# Altium schematic sheet Power_Supply_And_Regulator.SchDoc
size A4; DocumentNumber: 4; SheetNumber: 4
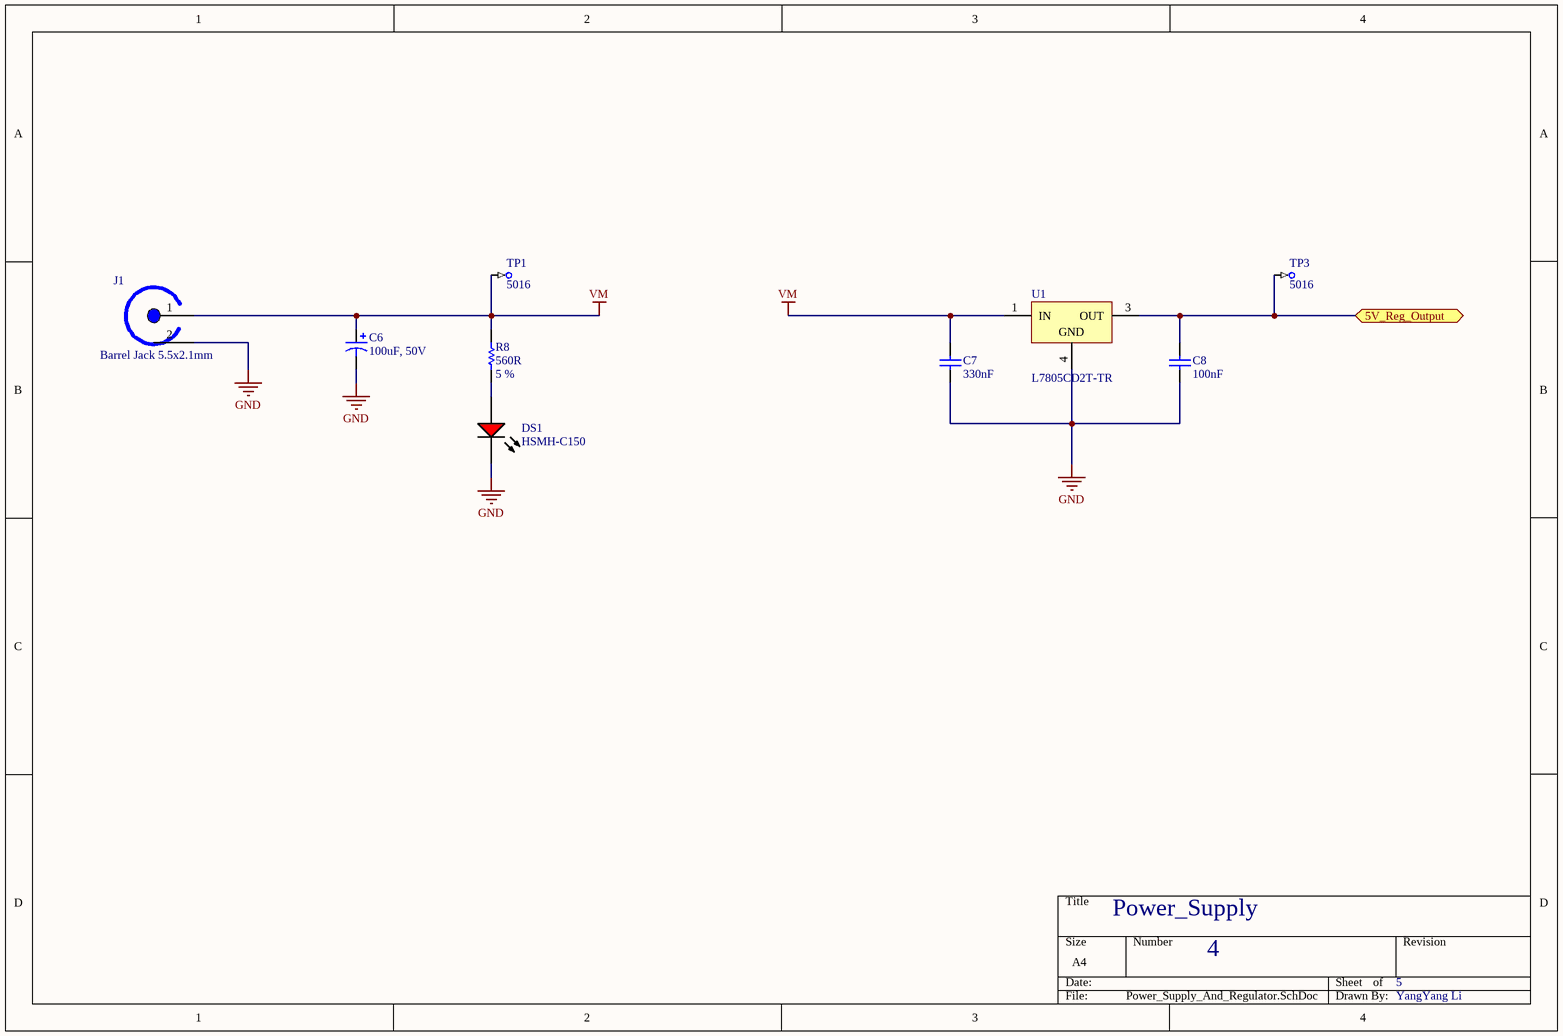
[diagram p0: Power_Supply_And_Regulator.SchDoc]

## Parts
C6  100uF, 50V  [Capacitor radial 8mm]
C7  330nF  [CAPC1608X87X35NL15T15]
C8  100nF  [CAPC2013X88X50NL20T25]
DS1  HSMH-C150  [AVAG-HSMX-C150_V]
J1  Barrel Jack 5.5x2.1mm  [Barrel Jack 2.1x5.5mm THT]
R8  value 560R  Tolerance: 5 %  [RESC1206(3216)_L]  (hidden comment: 560R 5% 1206(3216))
TP1  5016  [KEYSTONE-5016_V]
TP3  5016  [KEYSTONE-5016_V]
U1  L7805CD2T-TR  [TO-263_M]

## Ports
5V_Reg_Output (bidir)

## Nets
GND: C6.2 C7.1 C8.1 DS1.2(K) J1.2(SLEEVE) U1.4(GND)
VM: C6.1 C7.2 J1.1(TIP) R8.2 TP1.1 U1.1(IN)
5V_Reg_Output: C8.2 TP3.1 U1.3(OUT) ; port 5V_Reg_Output
NetDS1_1: DS1.1(A) R8.1

## Notes on the sheet
- Power_Supply
- 4
- 5
- YangYang Li

## Library data of the parts
C6 = Cap 100uF, 50V, THT radial: Electrolytic Capacitor, 100 µF, 50 V, ± 20%, Radial Leaded, 8 mm
C7 = CMP-2006-03186-1: C0603C334K4RACTU; Manufacturer: Kemet; Part Number: C0603C334K4RACTU
C8 = CMP-2007-00279-1: C0805C104K5RACTU; Manufacturer: Kemet; Part Number: C0805C104K5RACTU
DS1 = CMP-2000-06426-1: LED Uni-Color Red, 65 mW, 25 mA, -40 to 85 degC, 2-Pin SMD, RoHS, Tape and Reel; Manufacturer: Avago; Product Height (mm): 1.1mm; Power Dissipation: 78W; Product Length (mm): 3.2mm; Forward Voltage: 2.6V; Luminous Intensity: 17mcd; DELETED: Compliant; Shape Type: Rectangular; Peak Wavelength: 660nm; Main Category: ChipLED; Dominant Wave Length: 639nm; Rad Hardened: No; Lens Type: ColorlessDiffused; Product Depth (mm): 1.6mm; Reverse Voltage: 5V; Forward Current: 25mA; Chip Material: GaAlAs; Test Current (It): 20mA; Viewing Angle: 170deg; Number of  Elements: 1; Type: Uni-Color; Package Reference: HSMX-C150; Package Description: 2-Pin Surface Mount Device, Body 3.2 x 1.6 mm; Operating Temp Range: -40Cto85C; Mounting: SurfaceMount; Emitting Color: Red; Pin Count: 2; Operating Temperature Classification: Industrial; Datasheet URL: http://media.digikey.com/pdf/Data%20Sheets/Avago%20PDFs/HSMz-Czzz.pdf; Package Type: ChipLed; Mounting Technology: SurfaceMount; High Brightness: No; Lens Dimensions: 2x1.6x0.6mm; Manufacturer URL: http://www.avagotech.com/; Lum Intensity: 17mcd; Datasheet Version: 03/2012; Packaging: TapeandReel
J1 = Barrel Jack 5.5x2.1mm: GCT DCJ200-10-A-K1-K
R8 = CMP-1014-00068-1: 560R 0.25W 5% 1206 (3216 Metric)  SMD; Case-Metric: 3216; Case-EIA: 1206; Power: 0.25 W; Technology: SMT
TP1 TP3 = CMP-2000-05178-1: Test Point, 1-Pin SMT, RoHS, Tape and Reel; Manufacturer: Keystone; Other Names: 5016KDKR; Featured Product: SurfaceMountTestPoints / 5019MiniatureSurfaceMountTestPoint; Online Catalog: SurfaceMountTestPoints; Catalog Drawings: 5016Top / 5016Side / 5016Front; Packaging: Digi-Reel; RoHS Information: RoHSComplianceStatement; Package Reference: 5016; Mounting Type: SurfaceMount; Type: PCTestPoint,Compact; Manufacturer URL: http://www.keyelco.com/; Standard Package: 1; Package Description: 1-Pin Test Point, Body 3.81 x 2.04 mm; Category: TestandMeasurement; Terminal: 0.015"(0.38mm)PhosphorBronze,SilverPlated; Datasheet URL: https://ciiva.com/datasheet-click-2917613?src=ciiva&sig=4a4e90f; Datasheet Version: Rev. D, 03/2014; Family: TestPoints; Material: PhosphorBronze
U1 = CMP-0244-00213-1: Positive Voltage Regulator, 3-Pin D2PAK, Tape and Reel; PackageReference: TO-263; ComponentLink2URL: http://www.st.com/internet/com/TECHNICAL_RESOURCES/TECHNICAL_LITERATURE/DATASHEET/CD00000444.pdf; PackageDescription: 3-Pin Transistor Outline Package 2.54 mm Pitch, 15.4 mm Lead Span (D2PAK); DatasheetVersion: 16/11/2011; ComponentLink2Description: Datasheet; ComponentLink1Description: Manufacturer URL; PackageVersion: 2011; ComponentLink1URL: http://www.st.com